# EAGLE design RFID_Lock_Rev_1_PCB (EAGLE 9.4.2)
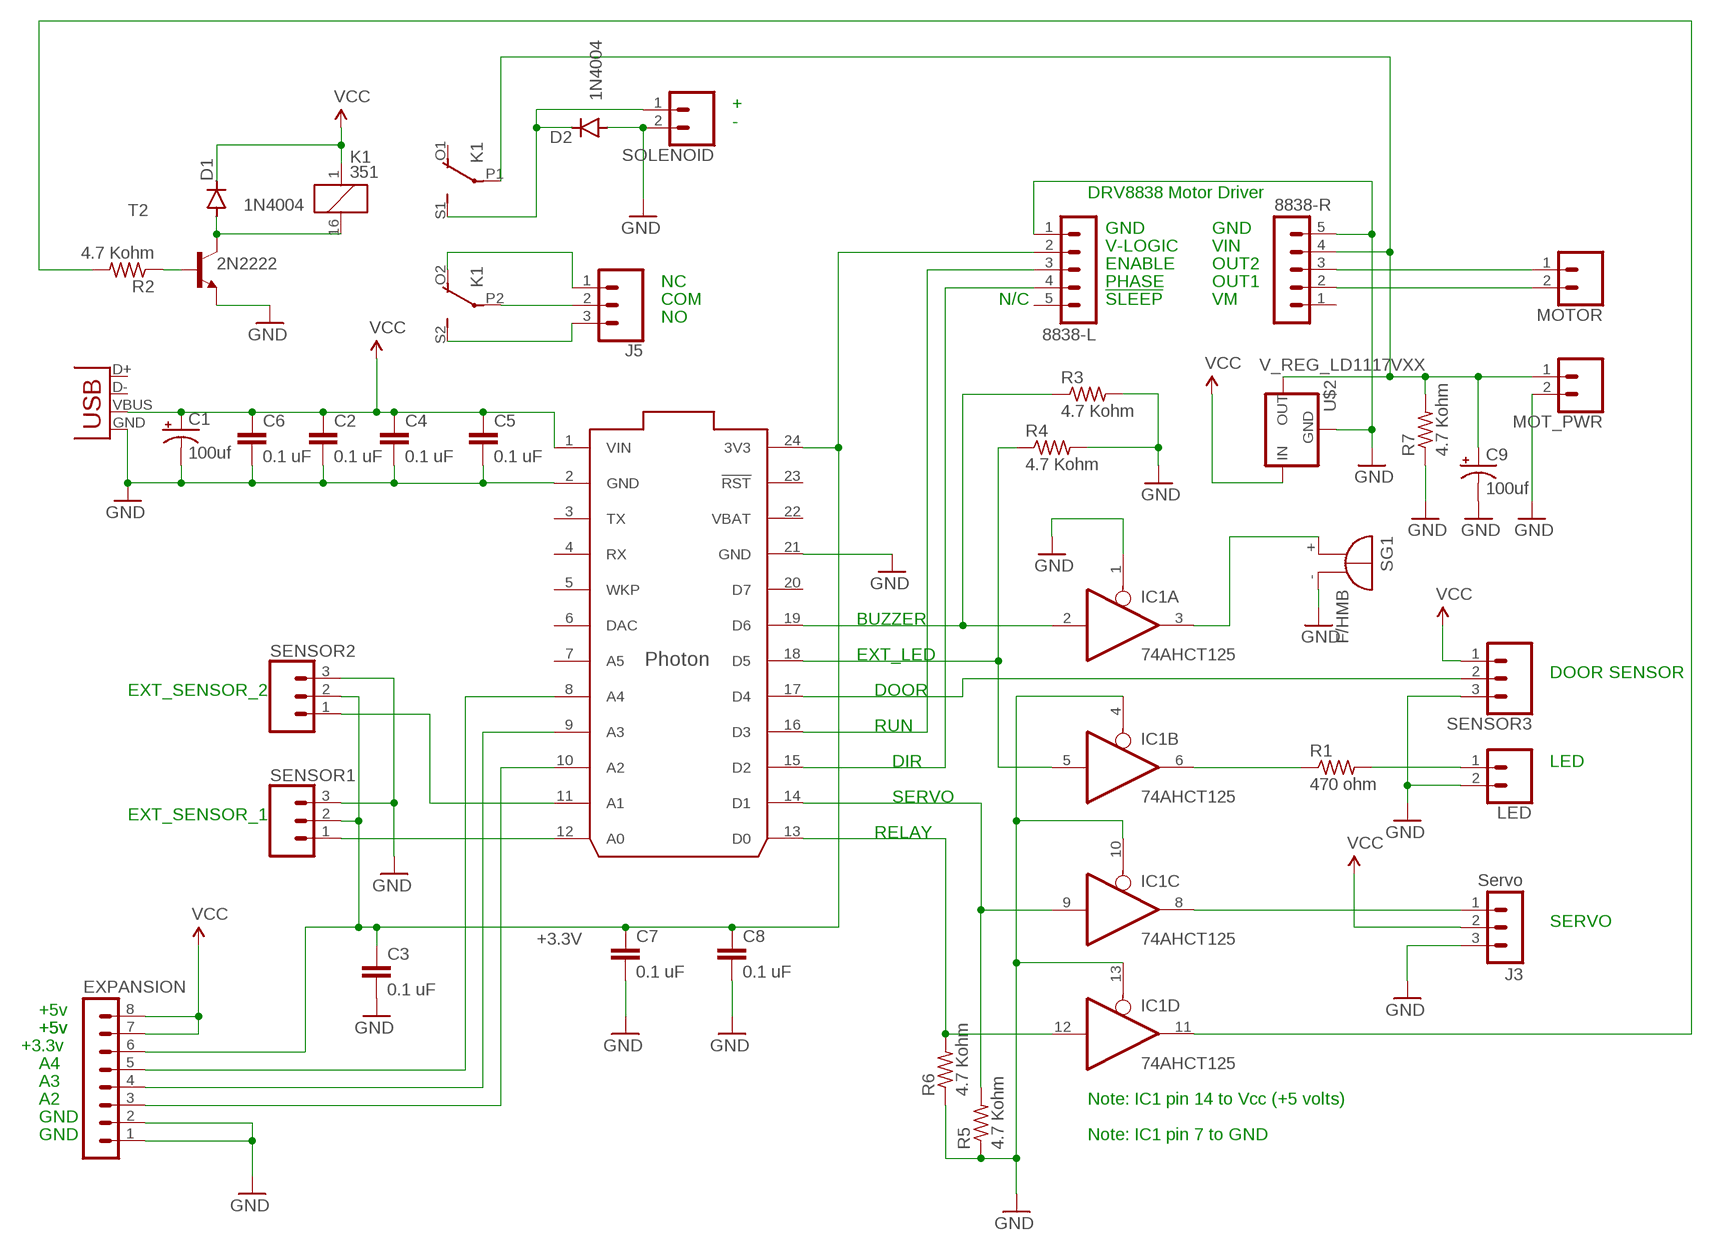
[diagram p0: schematic, sheet 1]

## Parts
8838-L  MA05-1  [MA05-1]
8838-R  MA05-1  [MA05-1]
C1  100uf  CAP_POLPTH1  [CPOL-RADIAL-100UF-25V]
C2  0.1 uF  CAPPTH  [CAP-PTH-SMALL]
C3  0.1 uF  CAPPTH  [CAP-PTH-SMALL]
C4  0.1 uF  CAPPTH  [CAP-PTH-SMALL]
C5  0.1 uF  CAPPTH  [CAP-PTH-SMALL]
C6  0.1 uF  CAPPTH  [CAP-PTH-SMALL]
C7  0.1 uF  CAPPTH  [CAP-PTH-SMALL]
C8  0.1 uF  CAPPTH  [CAP-PTH-SMALL]
C9  100uf  CAP_POLPTH1  [CPOL-RADIAL-100UF-25V]
D1  1N4004  [DO41-10]
D2  1N4004  [DO41-10]
EXPANSION  MA08-1  [MA08-1]
IC1  74AHCT125  74125N  [DIL14]
J3  Servo  MA03-1  [MA03-1]
J5  CONN_03SCREW  [SCREWTERMINAL-3.5MM-3]
JP1  USB-B  USBPTH  [USB-B-PTH]
K1  351  [351]
LED  CONN_023.5MM  [SCREWTERMINAL-3.5MM-2]
MOT_PWR  CONN_023.5MM  [SCREWTERMINAL-3.5MM-2]
MOTOR  CONN_023.5MM  [SCREWTERMINAL-3.5MM-2]
R1  470 ohm  R-US_0309/12  [0309/12]
R2  4.7 Kohm  R-US_0309/12  [0309/12]
R3  4.7 Kohm  R-US_0309/12  [0309/12]
R4  4.7 Kohm  R-US_0309/12  [0309/12]
R5  4.7 Kohm  R-US_0309/12  [0309/12]
R6  4.7 Kohm  R-US_0309/12  [0309/12]
R7  4.7 Kohm  R-US_0309/12  [0309/12]
SENSOR1  CONN_03SCREW  [SCREWTERMINAL-3.5MM-3]
SENSOR2  CONN_03SCREW  [SCREWTERMINAL-3.5MM-3]
SENSOR3  CONN_03SCREW  [SCREWTERMINAL-3.5MM-3]
SG1  F/HMB  [F/HMB]
SOLENOID  CONN_023.5MM  [SCREWTERMINAL-3.5MM-2]
T2  2N2222  [TO92-EBC-OVAL]
U$1  PHOTON_WITH_HEADERS  [PHOTON]
U$2  V_REG_LD1117VXX  [78XXL]

## Nets
+3.3V: 8838-L.2 C3.1 C7.1 C8.1 EXPANSION.6 SENSOR1.2 SENSOR2.2 U$1.24(3V3)
GND: 8838-L.1 8838-R.5 C1.2(-) C2.2 C3.2 C4.2 C5.2 C6.2 C7.2 C8.2 C9.2(-) D2.A EXPANSION.1 EXPANSION.2 IC1.1(A:OE) IC1.4(B:OE) IC1.10(C:OE) IC1.13(D:OE) J3.3 JP1.GND LED.2 MOT_PWR.2 R3.2 R4.2 R5.1 R6.1 R7.1 SENSOR1.3 SENSOR2.3 SENSOR3.3 SG1.- SOLENOID.2 T2.E U$1.2(GND) U$1.21(GND) U$2.IN(GND)
N$1: IC1.8(C:O) J3.1
N$2: SENSOR2.1 U$1.11(A1)
N$3: SENSOR1.1 U$1.12(A0)
N$4: IC1.2(A:I) R3.1 U$1.19(D6)
N$5: 8838-L.3 U$1.16(D3)
N$6: IC1.3(A:O) SG1.+
N$7: IC1.9(C:I) R5.2 U$1.14(D1)
N$8: 8838-R.3 MOTOR.1
N$9: IC1.6(B:O) R1.1
N$10: LED.1 R1.2
N$11: SENSOR3.2 U$1.17(D4)
N$12: 8838-L.4 U$1.15(D2)
N$13: 8838-R.2 MOTOR.2
N$15: EXPANSION.3 U$1.10(A2)
N$16: EXPANSION.4 U$1.9(A3)
N$17: IC1.12(D:I) R6.2 U$1.13(D0)
N$18: EXPANSION.5 U$1.8(A4)
N$19: IC1.11(D:O) R2.2
N$20: R2.1 T2.B
N$21: D1.A K1.16 T2.C
N$22: D2.C K1.S1(2:S) SOLENOID.1
N$23: IC1.5(B:I) R4.1 U$1.18(D5)
N$24: 8838-R.4 C9.1(+) K1.P1(2:P) MOT_PWR.1 R7.2 U$2.GND(OUT)
N$26: J5.2 K1.P2(3:P)
N$27: J5.1 K1.O2(3:O)
N$28: J5.3 K1.S2(3:S)
VCC: C1.1(+) C2.1 C4.1 C5.1 C6.1 D1.C EXPANSION.7 EXPANSION.8 J3.2 JP1.VBUS K1.1 SENSOR3.1 U$1.1(VIN) U$2.OUT(IN)
Unconnected: 8838-L.5 8838-R.1 JP1.D+ JP1.D- K1.O1(2:O) U$1.3(TX) U$1.4(RX) U$1.5(WKP) U$1.6(DAC) U$1.7(A5) U$1.20(D7) U$1.23(!RST)

## Notes on the sheet
- +
- -
- DRV8838 Motor Driver
- GND | GND
- V-LOGIC | VIN
- ENABLE | OUT2
- NC | PHASE | OUT1
- COM | N/C | !SLEEP | VM
- NO
- BUZZER
- EXT_LED
- DOOR SENSOR
- EXT_SENSOR_2 | DOOR
- RUN
- DIR | LED
- SERVO
- EXT_SENSOR_1
- RELAY
- SERVO
- +5v
- +5v | +5v
- +3.3v
- A4
- A3
- A2 | Note: IC1 pin 14 to Vcc (+5 volts)
- GND
- GND | Note: IC1 pin 7 to GND

## Power pins joined to a net without a drawn wire
GND: IC1.7(P:GND)
VBAT: U$1.22(VBAT)
VCC: IC1.14(P:VCC)

## Library data of the parts
8838-L 8838-R = con-lstb:MA05-1: PIN HEADER; OC_FARNELL: unknown; OC_NEWARK: unknown
C1 C9 = SparkFun-Capacitors:CAP_POL: Capacitor Polarized These are standard SMD and PTH capacitors. Normally 10uF, 47uF, and 100uF in electrolytic and tantalum varieties. Always verify the external diameter of the through hole cap, it varies with capacity, voltage, and manufacturer. The EIA devices should be standard.
C2-C8 = SparkFun-Passives:CAP: Capacitor Standard 0603 ceramic capacitor, and 0.1" leaded capacitor.
D1 D2 = diode:1N4004: DIODE general purpose rectifier, 1 A
EXPANSION = con-lstb:MA08-1: PIN HEADER; OC_FARNELL: unknown; OC_NEWARK: unknown
IC1 = 74xx-us:74*125: Quad bus BUFFER, 3-state
J3 = con-lstb:MA03-1: PIN HEADER; OC_FARNELL: unknown; OC_NEWARK: unknown
J5 SENSOR1-SENSOR3 = SparkFun-Connectors:CONN_03: Multi connection point. Often used as Generic Header-pin footprint for 0.1 inch spaced/style header connections On any of the 0.1 inch spaced packages, you can populate with these: Break Away Headers - Straight <https://www.sparkfun.com/products/116> (PRT-00116) Break Away Male Headers - Right Angle <https://www.sparkfun.com/products/553> (PRT-00553) Female Headers <https://www.sparkfun.com/products/115> (PRT-00115) Break Away Headers - Machine Pin <https://www.sparkfun.com/products/117> (PRT-00117) Break Away Female Headers - Swiss Machine Pin <https://www.sparkfun.com/products/743> (PRT-00743) Stackable Header - 3 Pin (Female, 0.1") <https://www.sparkfun.com/products/13875> (PRT-13875) For SCREWTERMINALS and SPRING TERMINALS visit here: Screw Terimnals on SparkFun.com <https://www.sparkfun.com/search/results?term=Screw+Terminals> (5mm/3.5mm/2.54mm spacing) This device is also useful as a general connection point to wire up your design to another part of your project. Our various solder wires solder well into these plated through hole pads. Hook-Up Wire - Assortment (Stranded, 22 AWG) <https://www.sparkfun.com/products/11375> (PRT-11375) Hook-Up Wire - Assortment (Solid Core, 22 AWG) <https://www.sparkfun.com/products/11367> (PRT-11367) View the entire wire category on our website here <https://www.sparkfun.com/categories/141> Special notes: Molex polarized connector foot print use with SKU : PRT-08232 with associated crimp pins and housings.; PROD_ID: CONN-08288; SF_ID: PRT-08235
JP1 = SparkFun-Connectors:USB: USB Connectors USB-B-PTH is fully proven SKU : PRT-00139/CONN-08278 USB-miniB is fully proven SKU : PRT-00587 USB-A-PCB is untested. USB-A-H is throughly reviewed, but untested. Spark Fun Electronics SKU : PRT-00437 USB-B-SMT is throughly reviewed, but untested. Needs silkscreen touching up. USB-A-S has not been used/tested USB-MB-H has not been used/tested USB-MICROB has been used. CONN-09505; PROD_ID: CONN-08278
K1 = relay:351: RELAY 2 x switch, Omron; OC_FARNELL: unknown; OC_NEWARK: unknown
LED MOT_PWR MOTOR SOLENOID = SparkFun-Connectors:CONN_02: Multi connection point. Often used as Generic Header-pin footprint for 0.1 inch spaced/style header connections On any of the 0.1 inch spaced packages, you can populate with these: Break Away Headers - Straight <https://www.sparkfun.com/products/116> (PRT-00116) Break Away Male Headers - Right Angle <https://www.sparkfun.com/products/553> (PRT-00553) Female Headers <https://www.sparkfun.com/products/115> (PRT-00115) Break Away Headers - Machine Pin <https://www.sparkfun.com/products/117> (PRT-00117) Break Away Female Headers - Swiss Machine Pin <https://www.sparkfun.com/products/743> (PRT-00743) For SCREWTERMINALS and SPRING TERMINALS visit here: Screw Terimnals on SparkFun.com <https://www.sparkfun.com/search/results?term=Screw+Terminals> (5mm/3.5mm/2.54mm spacing) This device is also useful as a general connection point to wire up your design to another part of your project. Our various solder wires solder well into these plated through hole pads. Hook-Up Wire - Assortment (Stranded, 22 AWG) <https://www.sparkfun.com/products/11375> (PRT-11375) Hook-Up Wire - Assortment (Solid Core, 22 AWG) <https://www.sparkfun.com/products/11367> (PRT-11367) View the entire wire category on our website here <https://www.sparkfun.com/categories/141> Special notes: Molex polarized connector foot print use with: PRT-08233 with associated crimp pins and housings. 2.54_SCREWTERM for use with PRT-10571. 3.5mm Screw Terminal footprints for PRT-08084 5mm Screw Terminal footprints for use with PRT-08432; PROD_ID: CONN-08399
R1-R7 = rcl:R-US_: RESISTOR, American symbol
SG1 = buzzer:F/HMB: BUZZER Source: Buerklin; OC_FARNELL: unknown; OC_NEWARK: unknown
T2 = adafruit:2N2222: NPN TRANSISTOR Big oval pads
U$1 = Spark:PHOTON
U$2 = SparkFun-IC-Power:V_REG_LD1117VXX: LD1117VXX voltage regulator. We carry the 3.3V version (COM-00526) in TO-220 package.

## Board
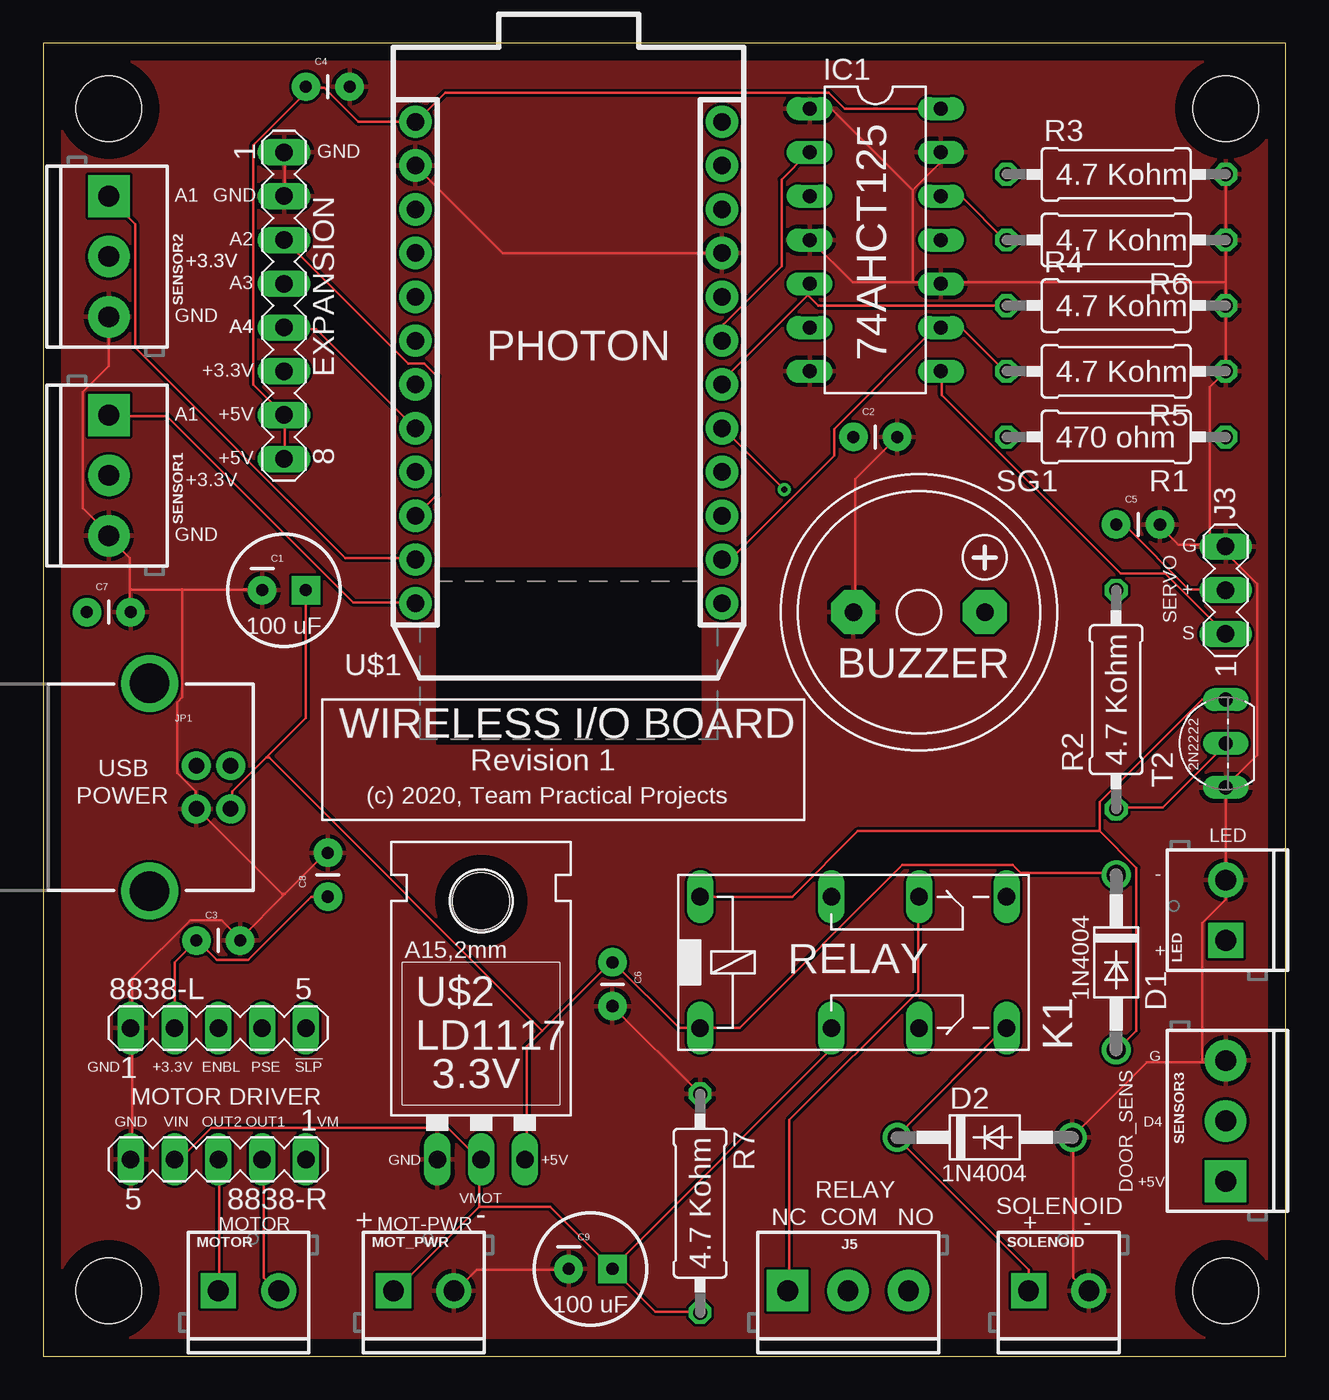
[diagram p1: board, top side]
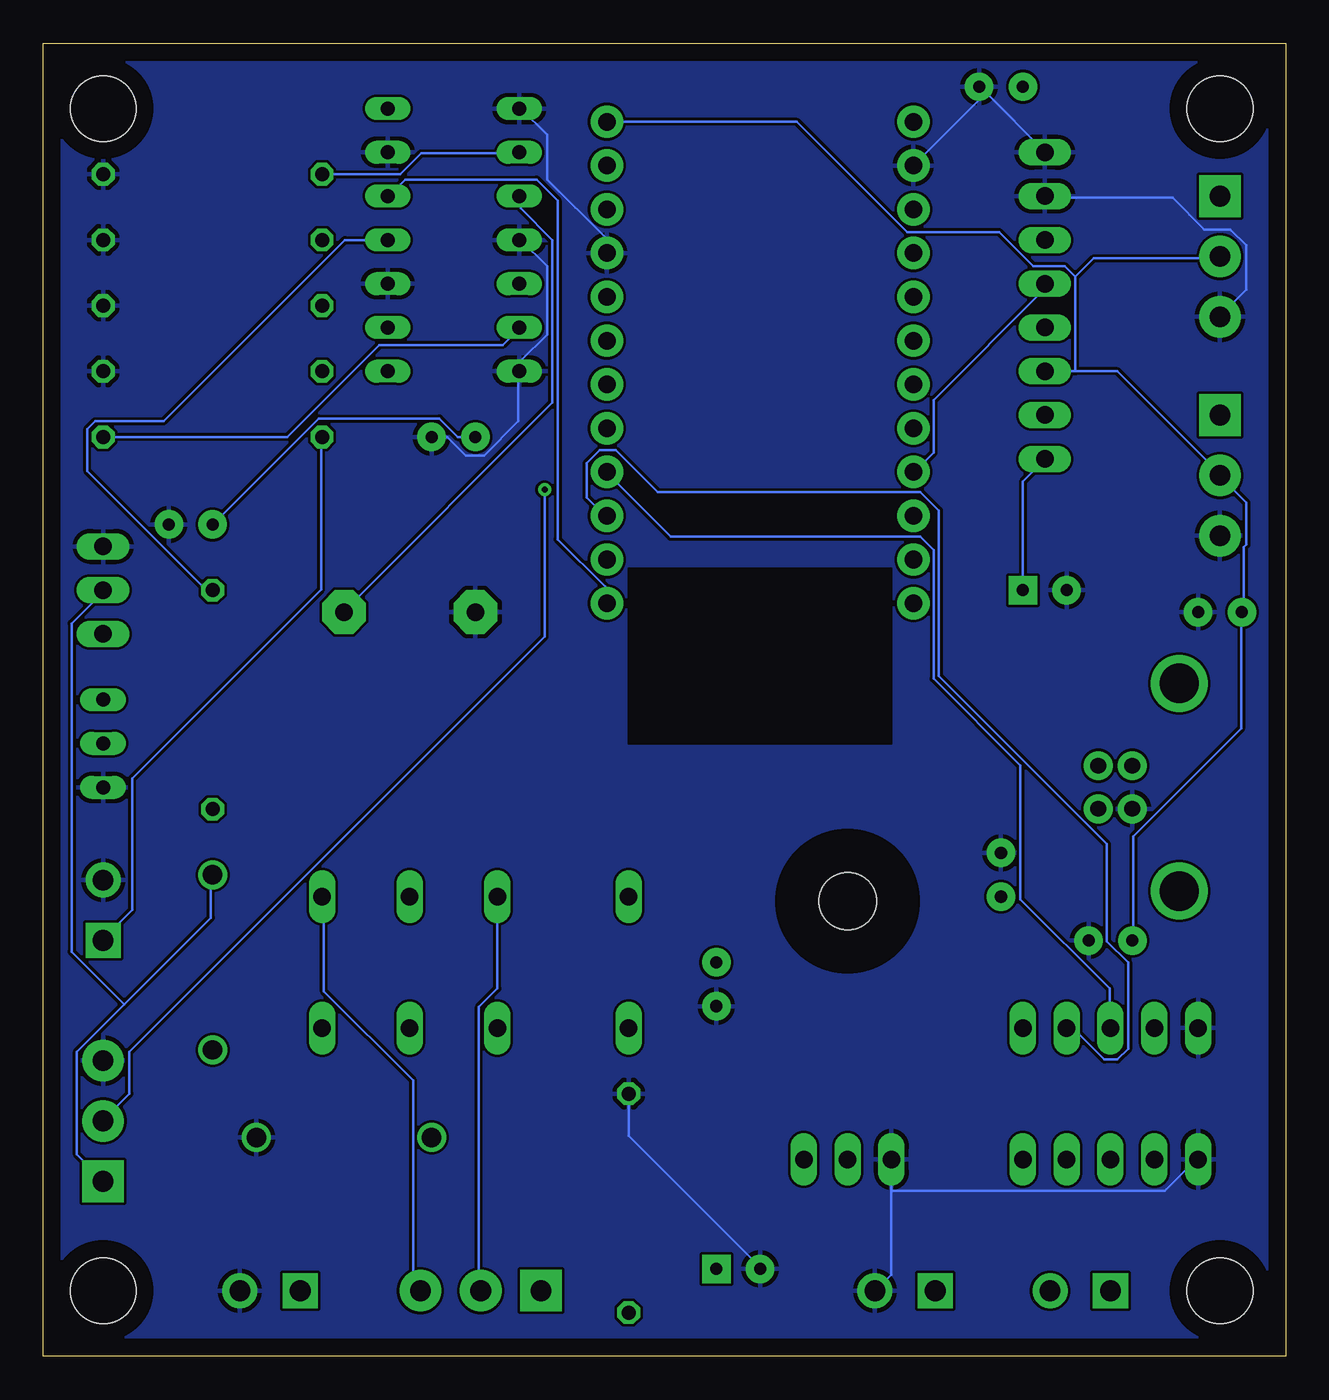
[diagram p2: board, bottom side, seen from below]

Size 72.06 x 76.19 mm. Coordinates in mm from the lower left corner, seen from the top.
Outline: 0,0 72.06,0 72.06,76.19 0,76.19 0,0
Copper layers (1*16): Top 0.035mm / dielectric 1.5mm / Bottom 0.035mm
Design rules "default": minimum track width 6mil, minimum drill 0.35mm, track to track 6mil, track to pad 6mil, pad to pad 6mil, via to via 6mil, smd to smd 6mil, copper to edge 40mil, drill to drill 6mil, minimum pad ring 10mil, minimum via ring 8mil, stop-mask expansion 4mil, vias tented up to drill 0mil, thermal gap 10mil
Holes 3.8 mm at 3.81,3.81 3.81,72.39 68.58,72.39 68.58,3.81
tRestrict: area 22.9,35.6 to 38.1,45.1; area 22.9,35.6 to 38.1,45.7
bRestrict: area 22.9,35.6 to 38.1,45.1; area 22.9,35.6 to 38.1,45.7

### Footprints (pad centres in the part's own frame; a part is rotated, then mirrored left to right if it is on the bottom)
MA05-1 = drill 1.016 long: 1 -5.08,0; 2 -2.54,0; 3 0,0; 4 2.54,0; 5 5.08,0
CPOL-RADIAL-100UF-25V = drill 0.7 pad 1.651 square: 1 1.27,0 | drill 0.7 pad 1.651: 2 -1.27,0
CAP-PTH-SMALL = drill 0.7 pad 1.651: 1 0,0; 2 2.54,0
DO41-10 = drill 1.118: A 5.08,0; C -5.08,0
MA08-1 = drill 1.016 long: 1 -8.89,0; 2 -6.35,0; 3 -3.81,0; 4 -1.27,0; 5 1.27,0; 6 3.81,0; 7 6.35,0; 8 8.89,0
DIL14 = drill 0.813 long: 1 -7.62,-3.81; 2 -5.08,-3.81; 3 -2.54,-3.81; 4 0,-3.81; 5 2.54,-3.81; 6 5.08,-3.81; 7 7.62,-3.81; 8 7.62,3.81; 9 5.08,3.81; 10 2.54,3.81; 11 0,3.81; 12 -2.54,3.81; 13 -5.08,3.81; 14 -7.62,3.81
MA03-1 = drill 1.016 long: 1 -2.54,0; 2 0,0; 3 2.54,0
SCREWTERMINAL-3.5MM-3 = drill 1.2 pad 2.413 square: 1 0,0 | drill 1.2 pad 2.413: 2 3.5,0; 3 7,0
USB-B-PTH = drill 0.914 pad 1.676: D+ 0,1.25; D- 1.981,1.25; GND 0,-1.25; VBUS 1.981,-1.25 | drill 2.286: S1 -2.718,-6.02; S2 -2.718,6.02
351 = drill 1.016 long: 1 -3.81,-3.81; 16 -3.81,3.81; O1 8.89,-3.81; O2 8.89,3.81; P1 3.81,-3.81; P2 3.81,3.81; S1 13.97,-3.81; S2 13.97,3.81
SCREWTERMINAL-3.5MM-2 = drill 1.2 pad 2.032 square: 1 0,0 | drill 1.2 pad 2.032: 2 3.5,0
0309/12 = drill 0.813 octagon: 1 -6.35,0; 2 6.35,0
F/HMB = drill 1.016 pad 2.54 octagon: + 3.81,0; - -3.81,0
TO92-EBC-OVAL = drill 0.813 long: B 0,-1.27; C 2.54,-1.27; E -2.54,-1.27
PHOTON = drill 1.016 pad 1.88: 1 1.27,32.258; 2 1.27,29.718; 3 1.27,27.178; 4 1.27,24.638; 5 1.27,22.098; 6 1.27,19.558; 7 1.27,17.018; 8 1.27,14.478; 9 1.27,11.938; 10 1.27,9.398; 11 1.27,6.858; 12 1.27,4.318; 13 19.05,4.318; 14 19.05,6.858; 15 19.05,9.398; 16 19.05,11.938; 17 19.05,14.478; 18 19.05,17.018; 19 19.05,19.558; 20 19.05,22.098; 21 19.05,24.638; 22 19.05,27.178; 23 19.05,29.718; 24 19.05,32.258
78XXL = drill 1.016 long: GND 0,-3.81; IN -2.54,-3.81; OUT 2.54,-3.81 | hole 3.302: 0,11.176

### Placement (x,y rotation side)
8838-L  10.16,19.05 0 top
8838-R  10.16,11.43 180 top
C1  13.97,44.45 0 top
C2  46.99,53.34 0 top
C3  8.89,24.13 0 top
C4  15.24,73.66 0 top
C5  62.23,48.26 0 top
C6  33.02,22.86 270 top
C7  2.54,43.18 0 top
C8  16.51,26.67 90 top
C9  31.75,5.08 0 top
D1  62.23,22.86 270 top
D2  54.61,12.7 0 top
EXPANSION  13.97,60.96 270 top
IC1  48.26,64.77 270 top
J3  68.58,44.45 90 top
J5  43.18,3.81 0 top
JP1  8.89,33.02 0 top
K1  41.91,22.86 0 top
LED  68.58,24.13 90 top
MOT_PWR  20.32,3.81 0 top
MOTOR  10.16,3.81 0 top
R1  62.23,53.34 180 top
R2  62.23,38.1 90 top
R3  62.23,68.58 0 top
R4  62.23,60.96 0 top
R5  62.23,57.15 180 top
R6  62.23,64.77 180 top
R7  38.1,8.89 270 top
SENSOR1  3.81,54.61 270 top
SENSOR2  3.81,67.31 270 top
SENSOR3  68.58,10.16 90 top
SG1  50.8,43.18 0 top
SOLENOID  57.15,3.81 0 top
T2  67.31,35.56 90 top
U$1  20.32,39.37 0 top
U$2  25.4,15.24 0 top

### Tracks (layer width: path | path; a pad name or v marks a point on that pad's centre or on a via)
+3.3V
  Top 0.152: 8838-L.2 7.62,22.86 C3.1 8.99,24.08 10.06,23.01 11.89,23.01 15.54,26.67 C8.1
  Bottom 0.152: 12.19,57.15 9.75,57.15 3.81,51.21 SENSOR1.2 3.81,51.05 2.29,49.53 2.29,47.09 2.44,46.94 2.44,43.28 C7.1 2.59,43.13 2.59,36.42 8.84,30.18 8.84,24.23 C3.1 | 12.19,57.15 EXPANSION.6 | U$1.24 28.35,71.63 21.95,65.23 16.61,65.23 14.63,63.25 12.8,63.25 12.19,62.64 | 12.19,57.15 12.19,62.64 | 12.19,62.64 11.12,63.7 3.81,63.7 SENSOR2.2
GND
  Top 0.152: 50.44,62.33 46.94,62.33 44.5,64.77 IC1.4 | 50.44,62.33 51.97,62.33 IC1.10 52.12,62.33 68.58,62.33 | 50.44,67.67 51.97,69.19 51.97,69.8 IC1.13 | 50.44,62.33 50.44,67.67 | IC1.1 45.72,72.39 50.44,67.67 | C2.2 47.09,50.9 47.09,43.28 SG1.- | 67.67,47.09 65.84,47.09 64.77,48.16 C5.2 | 67.67,47.09 68.58,47.09 J3.3 | R3.2 R6.1 68.58,62.33 | 68.58,62.33 R4.2 R5.1 67.67,56.24 67.67,47.09 | 67.67,47.09 J3.3 | SOLENOID.2 60.5,3.81 59.74,4.57 59.74,12.65 D2.A 59.74,12.8 64.01,17.07 67.21,17.07 | 67.21,17.07 68.58,17.07 SENSOR3.3 | 67.21,17.07 67.21,25.15 68.58,26.52 LED.2 T2.E 68.58,33.07 70.41,34.9 70.41,44.81 68.58,46.63 J3.3 | C6.2 R7.1 | C9.2 30.48,5.03 25.15,5.03 23.93,3.81 MOT_PWR.2 | 5.18,19.05 5.18,11.43 8838-R.5 | 14.02,26.82 16.46,29.26 C8.2 | 14.02,26.82 11.43,24.23 | 14.02,26.82 13.87,26.82 8.99,31.7 JP1.GND 8.84,31.85 8.84,32.77 7.77,33.83 7.77,37.95 8.08,38.25 8.08,44.5 | 5.18,19.05 5.18,21.95 8.53,25.3 10.36,25.3 11.43,24.23 | 5.18,19.05 8838-L.1 | 11.43,24.23 C3.2 | EXPANSION.2 14.02,67.36 14.02,69.8 EXPANSION.1 | 5.03,44.5 5.03,46.33 3.81,47.55 SENSOR1.3 3.81,47.7 2.29,49.23 2.29,55.93 3.81,57.45 SENSOR2.3 | 5.03,44.5 5.03,43.28 C7.2 | 5.03,44.5 8.08,44.5 | 8.08,44.5 12.65,44.5 C1.2 | U$1.21 26.67,64.01 U$1.2
  Bottom 0.152: IC1.4 44.35,64.77 42.82,63.25 42.82,59.28 44.35,57.76 44.35,57.15 IC1.7 44.5,57.15 44.5,54.25 46.48,52.27 47.55,52.27 48.62,53.34 C2.2 | U$1.21 39.47,64.01 39.47,64.92 42.82,68.28 42.82,70.87 44.35,72.39 IC1.1 | 22.86,9.6 22.86,4.72 23.77,3.81 MOT_PWR.2 | 22.86,9.6 U$2.IN | R7.1 38.1,12.8 30.48,5.18 C9.2 | 17.37,73.3 14.02,69.95 EXPANSION.1 | 17.37,73.3 17.68,73.61 C4.2 17.37,73.3 | 17.37,73.3 U$1.2 | EXPANSION.2 13.87,67.21 6.55,67.21 4.72,65.38 3.2,65.38 2.29,64.47 2.29,61.87 3.81,60.35 SENSOR2.3 | 22.86,9.6 7.01,9.6 5.18,11.43 8838-R.5
  pour Top: 0,0 0,76.2 72.39,76.2 72.39,0
  pour Bottom: 0,0 0,76.2 72.39,76.2 72.39,0
N$1
  Top 0.152: J3.1 65.08,45.41 62.48,45.41 52.12,55.78 52.12,57.15 IC1.8
N$2
  Top 0.152: U$1.11 21.49,46.33 17.53,46.33 5.33,58.52 5.33,65.68 3.81,67.21 SENSOR2.1
N$3
  Top 0.152: U$1.12 21.49,43.74 17.98,43.74 7.16,54.56 3.81,54.56 SENSOR1.1
N$4
  Top 0.152: U$1.19 39.47,58.98 39.47,59.89 42.82,63.25 42.82,68.28 44.35,69.8 IC1.2
  Bottom 0.152: R3.1 51.36,68.58 50.14,69.8 44.5,69.8 IC1.2
N$5
  Bottom 0.152: 8838-L.3 10.21,19.05 10.21,21.34 15.39,26.52 15.39,34.29 20.42,39.32 20.42,46.79 21.18,47.55 35.66,47.55 39.32,51.21 U$1.16
N$6
  Bottom 0.152: IC1.3 44.35,67.21 44.35,66.6 42.52,64.77 42.52,55.32 54.56,43.28 SG1.+
N$7
  Top 0.152: R5.2 55.78,57.15 53.34,59.59 52.12,59.59 IC1.9 51.97,59.59 51.66,59.59 45.87,53.8 45.87,52.27 39.93,46.33 39.47,46.33 U$1.14
N$8
  Top 0.152: 8838-R.3 10.21,11.43 10.21,3.81 MOTOR.1
N$9
  Bottom 0.152: R1.1 57.91,53.34 52.58,58.67 45.41,58.67 44.5,59.59 IC1.6
N$10
  Bottom 0.152: R1.2 55.93,53.34 55.93,44.5 66.9,33.53 66.9,25.91 68.58,24.23 LED.1
N$11  (via drill 0.35)
  Top 0.152: v42.98,50.29 39.47,53.8 U$1.17
  Bottom 0.152: v42.98,50.29 42.98,41.76 67.06,17.68 67.06,15.24 68.58,13.72 SENSOR3.2
N$12
  Bottom 0.152: 8838-L.4 12.34,19.05 10.52,17.22 9.75,17.22 9.14,17.83 9.14,22.86 10.36,24.08 10.36,29.72 20.12,39.47 20.12,49.07 21.18,50.14 36.42,50.14 38.86,52.58 39.78,52.58 40.54,51.82 40.54,49.84 39.47,48.77 U$1.15
N$13
  Top 0.152: 8838-R.2 12.8,11.43 12.8,4.57 13.56,3.81 MOTOR.2
N$15
  Top 0.152: EXPANSION.3 14.02,64.77 21.18,57.61 22.1,57.61 22.86,56.84 22.86,49.99 21.64,48.77 U$1.10
N$16
  Bottom 0.152: EXPANSION.4 14.02,62.18 14.02,61.87 20.42,55.47 20.42,52.43 21.49,51.36 U$1.9
N$17
  Top 0.152: IC1.12 52.12,67.21 53.34,67.21 55.78,64.77 R6.2
  Bottom 0.152: U$1.13 39.47,43.74 39.47,44.65 42.22,47.4 42.22,67.06 43.43,68.28 51.05,68.28 51.97,67.36 IC1.12
N$18
  Top 0.152: U$1.8 15.85,59.59 14.02,59.59 EXPANSION.5
N$19
  Bottom 0.152: IC1.11 54.56,64.77 65.08,54.25 69.04,54.25 69.49,53.8 69.49,51.36 62.64,44.5 62.33,44.5 R2.2
N$20
  Top 0.152: R2.1 62.33,31.85 64.92,31.85 68.58,35.51 T2.B
N$21
  Top 0.152: T2.C 67.21,38.1 61.27,32.16 61.27,30.48 | 61.27,30.48 63.4,28.35 63.4,18.9 62.33,17.83 D1.A | K1.16 43.43,26.67 47.24,30.48 61.27,30.48
N$22
  Top 0.152: K1.S1 55.78,19.05 49.53,12.8 D2.C 49.53,12.65 57.15,5.03 SOLENOID.1
N$23
  Top 0.152: 44.35,61.57 44.35,62.18 IC1.5 | 44.35,61.57 39.47,56.69 39.47,56.39 U$1.18 | R4.1 44.96,60.96 44.35,61.57
N$24
  Top 0.152: 25.3,8.69 25.3,11.43 | 25.3,8.69 20.42,3.81 MOT_PWR.1 | C9.1 35.51,2.59 38.1,2.59 R7.2 | K1.P1 45.72,17.83 33.07,5.18 C9.1 | 25.3,8.69 29.41,8.69 C9.1 | 8838-R.4 7.92,11.43 9.75,13.26 23.47,13.26 25.3,11.43 | 25.3,11.43 U$2.GND
N$26
  Bottom 0.152: K1.P2 45.72,21.34 46.79,20.27 46.79,3.81 J5.2
N$27
  Top 0.152: K1.O2 50.75,26.67 50.75,21.18 43.28,13.72 43.28,3.81 J5.1
N$28
  Bottom 0.152: K1.S2 55.78,26.67 55.78,21.18 50.6,16 50.6,4.12 50.29,3.81 J5.3
VCC
  Top 0.152: J3.2 68.58,44.5 66.45,44.5 62.79,48.16 62.33,48.16 C5.1 | IC1.14 46.48,72.39 45.57,73.3 23.32,73.3 21.64,71.63 U$1.1 18.29,71.63 16.31,73.61 15.24,73.61 | 28.96,18.9 32.92,22.86 C6.1 33.07,22.86 36.88,19.05 K1.1 40.39,19.05 49.84,28.5 56.24,28.5 56.69,28.04 62.18,28.04 D1.C | 28.96,18.9 28.04,17.98 28.04,11.43 U$2.OUT | EXPANSION.8 14.02,52.12 14.02,54.56 EXPANSION.7 12.19,56.39 12.19,70.26 15.24,73.3 15.24,73.61 | 12.95,34.75 15.24,37.03 C1.1 | 12.95,34.75 10.97,32.77 10.97,31.85 JP1.VBUS | 28.96,18.9 13.11,34.75 12.95,34.75 | 15.24,73.61 C4.1
  Bottom 0.152: 67.36,20.42 70.1,17.68 70.1,11.73 68.58,10.21 SENSOR3.1 | 67.36,20.42 62.33,25.45 62.33,27.89 D1.C | C2.1 48.01,53.34 49.07,54.41 56.08,54.41 C5.1 | 67.36,20.42 70.41,23.47 70.41,42.52 68.58,44.35 J3.2 | C1.1 15.24,50.75 14.02,51.97 EXPANSION.8

### Text on the board
tPlace: GND | 4.7 Kohm | A1 | GND | A2 | 4.7 Kohm | +3.3V | +3.3V | A3 | GND | 4.7 Kohm | A4 | A4 | PHOTON | 74AHCT125 | +3.3V | 4.7 Kohm | A1 | +5V | 470 ohm | +5V | +3.3V | GND | G | + | SERVO | 100 uF | S | BUZZER | WIRELESS I/O BOARD | USB | Revision 1 | 4.7 Kohm | 2N2222 | POWER | (c) 2020, Team Practical Projects | LED | - | + | RELAY | 1N4004 | LD1117 | GND | +3.3V | ENBL | PSE | !SLP | G | 3.3V | MOTOR DRIVER | GND | VIN | OUT2 | OUT1 | VM | D4 | GND | +5V | 1N4004 | DOOR_SENS | +5V | VMOT | RELAY | - | NC | COM | NO | SOLENOID | MOTOR | + | MOT-PWR | + | - | 4.7 Kohm | 100 uF